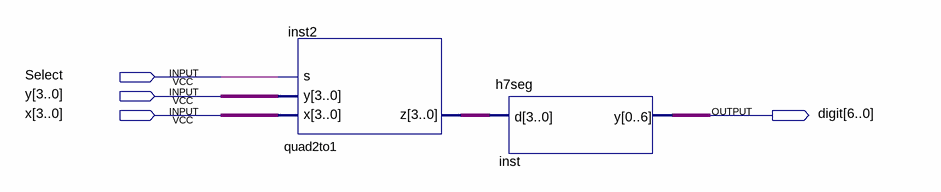
[diagram p0: schematic sheet]
// Quartus schematic mux_application.bdf as structural Verilog: 2 symbols, 4 pins
module mux_application (
  input  Select,
  input  [3:0] y,
  input  [3:0] x,
  output [6:0] digit
);

  wire [3:0] inst2_z;

  quad2to1 inst2 (.x(x), .y(y), .s(Select), .z(inst2_z));
  h7seg inst (.d(inst2_z), .y(digit));
endmodule
